# EAGLE design Motor board (2020 edit) (EAGLE 9.5.2)
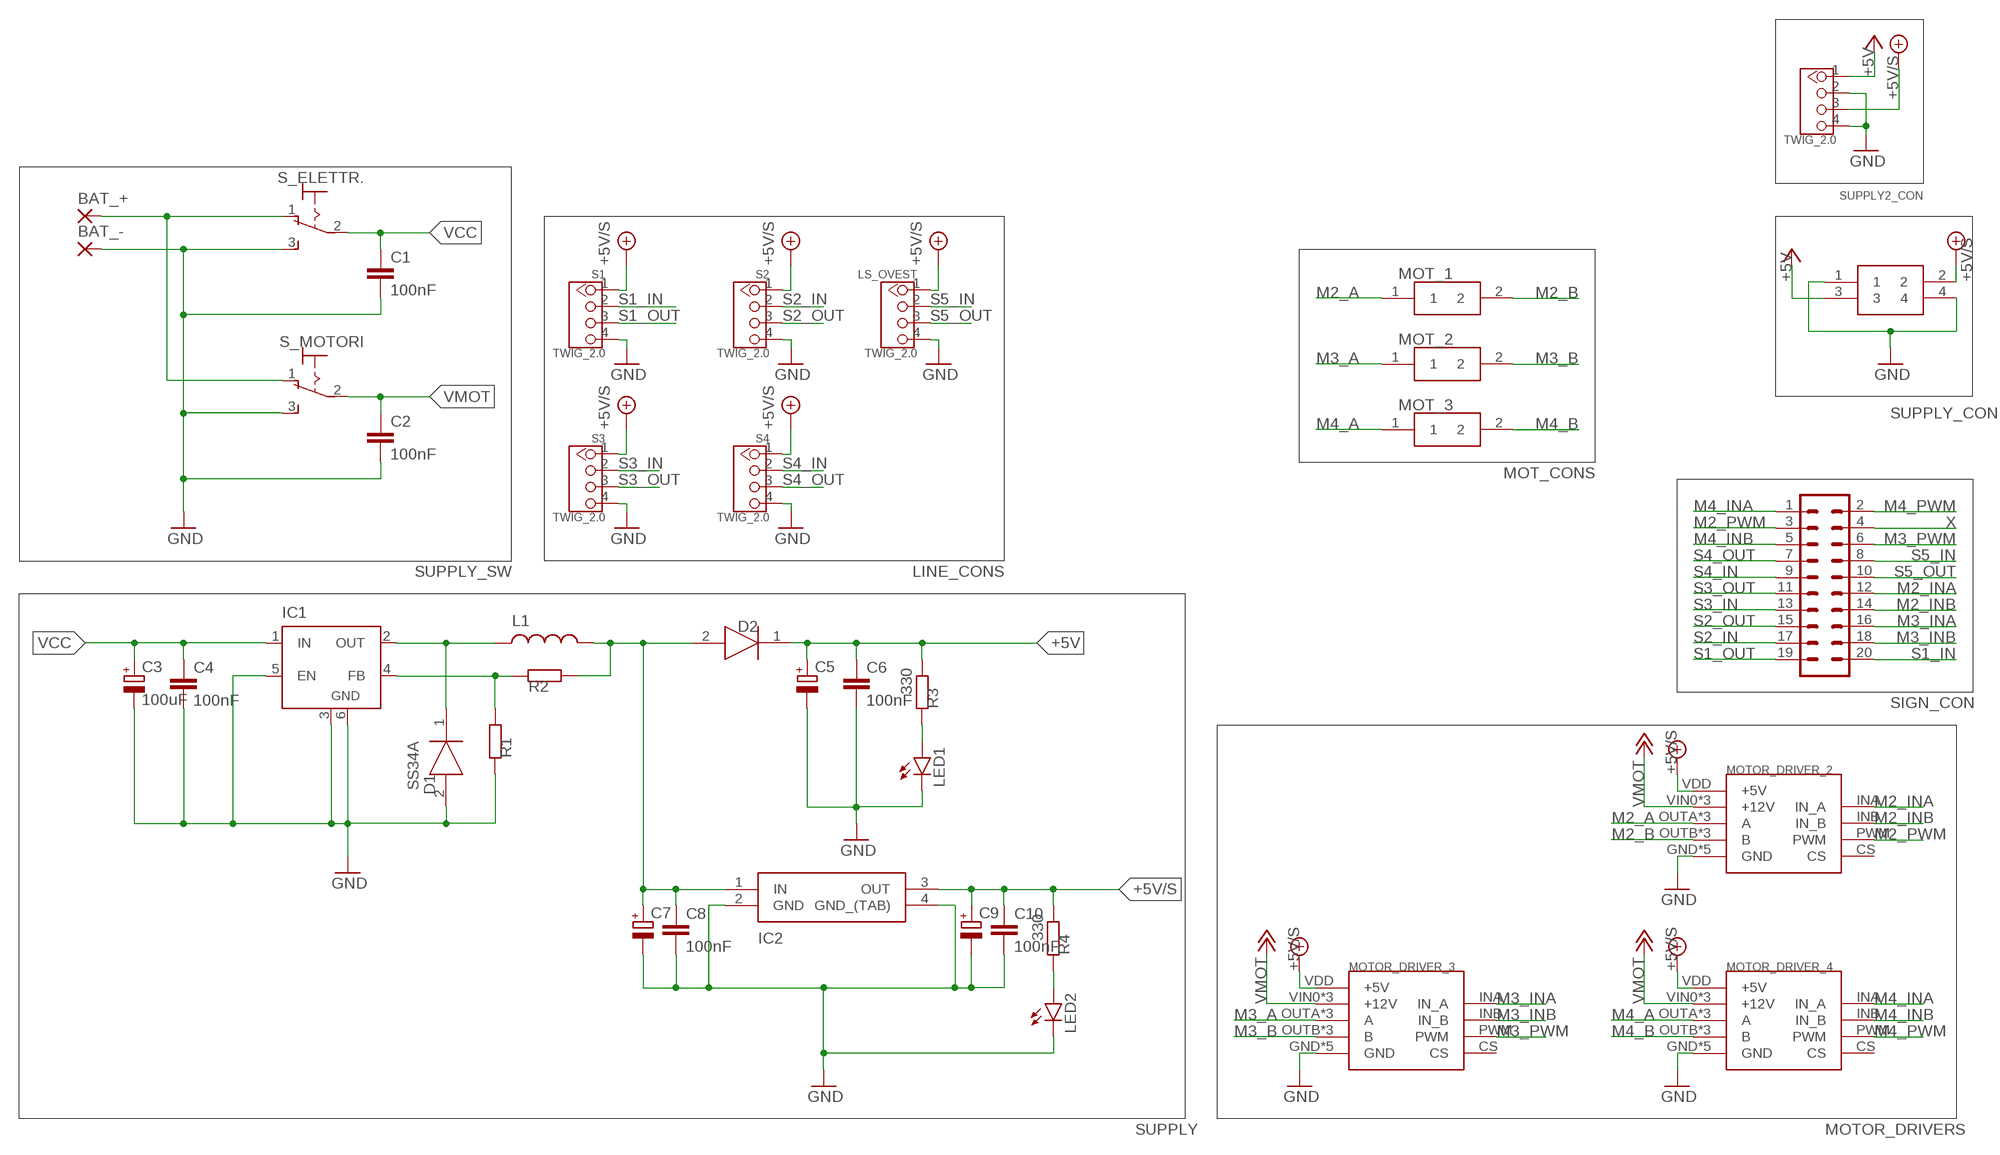
[diagram p0: schematic, sheet 1]

## Parts
BAT_+  3,81/1,4  [3,81/1,4]
BAT_-  3,81/1,4  [3,81/1,4]
C1  100nF  C-EUC1206  [C1206]
C2  100nF  C-EUC1206  [C1206]
C3  100uF  CPOL-EUCT7343  [CT7343]
C4  100nF  C-EUC1206  [C1206]
C5  CPOL-EUE  [PANASONIC_E]
C6  100nF  C-EUC1206  [C1206]
C7  CPOL-EUE  [PANASONIC_E]
C8  100nF  C-EUC1206  [C1206]
C9  CPOL-EUE  [PANASONIC_E]
C10  100nF  C-EUC1206  [C1206]
D1  SS34A  [DIOM5026X262N]
D2  SE20FG-M3_H  [SODFL3718X108N]
IC1  LM2596S  [TO263-5]
IC2  LM2940CS-5.0_NOPB  [TO254P1435X464-4N]
L1  47uH  MSS1260  [MSS1260]
LED1  LEDSML1206  [SML1206]
LED2  LEDSML1206  [SML1206]
LS_OVEST  TWIG_2.0  [2.0_1X4]
MOT_1  43650-0201  [43650-0200]
MOT_2  43650-0201  [43650-0200]
MOT_3  43650-0201  [43650-0200]
MOTOR_DRIVER_2  VNH5019  [VNH5019]
MOTOR_DRIVER_3  VNH5019  [VNH5019]
MOTOR_DRIVER_4  VNH5019  [VNH5019]
R1  330  R-EU_R1206  [R1206]
R2  1,2k  R-EU_R1206  [R1206]
R3  330  R-EU_R1206  [R1206]
R4  330  R-EU_R1206  [R1206]
S1  TWIG_2.0  [2.0_1X4]
S2  TWIG_2.0  [2.0_1X4]
S3  TWIG_2.0  [2.0_1X4]
S4  TWIG_2.0  [2.0_1X4]
S_ELETTR.  320-916  [320-916]
S_MOTORI  320-916  [320-916]
SIGN_CON  20V  [20V]
SUPPLY2_CON  TWIG_2.0  [2.0_1X4]
SUPPLY_CON  39-28-1043  [39-28-1043]

## Nets
5.7V-DIRAMAZIONE2: C7.+ C8.1 D2.2(A) IC2.1(IN) L1.P$1 R2.1
+5V: C5.+ C6.1 D2.1(K) R3.1 SUPPLY2_CON.1 SUPPLY_CON.3
+5V/S: C9.+ C10.1 IC2.3(OUT) LS_OVEST.1 MOTOR_DRIVER_2.VDD(+5V) MOTOR_DRIVER_3.VDD(+5V) MOTOR_DRIVER_4.VDD(+5V) R4.1 S1.1 S2.1 S3.1 S4.1 SUPPLY2_CON.3 SUPPLY_CON.2 ; supply symbol labelled +5V/1
GND [Power]: BAT_-.1(P) C1.2 C2.2 C3.- C4.2 C5.- C6.2 C7.- C8.2 C9.- C10.2 D1.2(A) IC1.3(GND) IC1.5(EN) IC1.6(GND) IC2.2(GND) IC2.4(GND_(TAB)) LED1.C LED2.C LS_OVEST.4 MOTOR_DRIVER_2.GND MOTOR_DRIVER_2.GND0(GND) MOTOR_DRIVER_2.GND1(GND) MOTOR_DRIVER_2.GND2(GND) MOTOR_DRIVER_2.GND3(GND) MOTOR_DRIVER_3.GND MOTOR_DRIVER_3.GND0(GND) MOTOR_DRIVER_3.GND1(GND) MOTOR_DRIVER_3.GND2(GND) MOTOR_DRIVER_3.GND3(GND) MOTOR_DRIVER_4.GND MOTOR_DRIVER_4.GND0(GND) MOTOR_DRIVER_4.GND1(GND) MOTOR_DRIVER_4.GND2(GND) MOTOR_DRIVER_4.GND3(GND) R1.1 S1.4 S2.4 S3.4 S4.4 S_ELETTR..3(S) S_MOTORI.3(S) SUPPLY2_CON.2 SUPPLY2_CON.4 SUPPLY_CON.1 SUPPLY_CON.4
M2_A: MOT_1.1 MOTOR_DRIVER_2.OUTA2(A) MOTOR_DRIVER_2.OUTA3(A) MOTOR_DRIVER_2.OUTA(A)
M2_B: MOT_1.2 MOTOR_DRIVER_2.OUTB1(B) MOTOR_DRIVER_2.OUTB3(B) MOTOR_DRIVER_2.OUTB(B)
M2_INA: MOTOR_DRIVER_2.INA(IN_A) SIGN_CON.12
M2_INB: MOTOR_DRIVER_2.INB(IN_B) SIGN_CON.14
M2_PWM: MOTOR_DRIVER_2.PWM SIGN_CON.3
M3_A: MOT_2.1 MOTOR_DRIVER_3.OUTA2(A) MOTOR_DRIVER_3.OUTA3(A) MOTOR_DRIVER_3.OUTA(A)
M3_B: MOT_2.2 MOTOR_DRIVER_3.OUTB1(B) MOTOR_DRIVER_3.OUTB3(B) MOTOR_DRIVER_3.OUTB(B)
M3_INA: MOTOR_DRIVER_3.INA(IN_A) SIGN_CON.16
M3_INB: MOTOR_DRIVER_3.INB(IN_B) SIGN_CON.18
M3_PWM: MOTOR_DRIVER_3.PWM SIGN_CON.6
M4_A: MOT_3.1 MOTOR_DRIVER_4.OUTA2(A) MOTOR_DRIVER_4.OUTA3(A) MOTOR_DRIVER_4.OUTA(A)
M4_B: MOT_3.2 MOTOR_DRIVER_4.OUTB1(B) MOTOR_DRIVER_4.OUTB3(B) MOTOR_DRIVER_4.OUTB(B)
M4_INA: MOTOR_DRIVER_4.INA(IN_A) SIGN_CON.1
M4_INB: MOTOR_DRIVER_4.INB(IN_B) SIGN_CON.5
M4_PWM: MOTOR_DRIVER_4.PWM SIGN_CON.2
N$1 [Power]: BAT_+.1(P) S_ELETTR..1(O) S_MOTORI.1(O)
N$2: LED2.A R4.2
N$3: LED1.A R3.2
N$6: D1.1(K) IC1.2(OUT) L1.P$2
N$7: IC1.4(FB) R1.2 R2.2
S1_IN: S1.2 SIGN_CON.20
S1_OUT: S1.3 SIGN_CON.19
S2_IN: S2.2 SIGN_CON.17
S2_OUT: S2.3 SIGN_CON.15
S3_IN: S3.2 SIGN_CON.13
S3_OUT: S3.3 SIGN_CON.11
S4_IN: S4.2 SIGN_CON.9
S4_OUT: S4.3 SIGN_CON.7
S5_IN: LS_OVEST.2 SIGN_CON.8
S5_OUT: LS_OVEST.3 SIGN_CON.10
VCC: C1.1 C3.+ C4.1 IC1.1(IN) S_ELETTR..2(P)
VMOT [Power]: C2.1 MOTOR_DRIVER_2.VIN0(+12V) MOTOR_DRIVER_2.VIN1(+12V) MOTOR_DRIVER_2.VIN2(+12V) MOTOR_DRIVER_3.VIN0(+12V) MOTOR_DRIVER_3.VIN1(+12V) MOTOR_DRIVER_3.VIN2(+12V) MOTOR_DRIVER_4.VIN0(+12V) MOTOR_DRIVER_4.VIN1(+12V) MOTOR_DRIVER_4.VIN2(+12V) S_MOTORI.2(P) ; supply symbol labelled +12V
X: SIGN_CON.4
Unconnected: MOTOR_DRIVER_2.CS MOTOR_DRIVER_3.CS MOTOR_DRIVER_4.CS

## Notes on the sheet
- MOT_CONS
- SUPPLY_SW | LINE_CONS
- SUPPLY | MOTOR_DRIVERS

## Library data of the parts
BAT_+ BAT_- = wirepad:3,81/1,4: THROUGH-HOLE PAD
C1 C2 C4 C6 C8 C10 = rcl:C-EU: CAPACITOR, European symbol; SPICEPREFIX: C
C3 C5 C7 C9 = rcl:CPOL-EU: POLARIZED CAPACITOR, European symbol; SPICEPREFIX: C
D1 = SamacSys_Parts:SS34A: HY Electronic Corp SS34A, SMT Rectifier Schottky Diode, 40V 3A, 2-Pin SMA Source: Datasheet <http://uk.rs-online.com/web/p/products/1711454>; DESCRIPTION: HY Electronic Corp SS34A, SMT Rectifier Schottky Diode, 40V 3A, 2-Pin SMA; HEIGHT: 2.62mm; MANUFACTURER_NAME: HY Electronic Corp; MANUFACTURER_PART_NUMBER: SS34A; RS_PART_NUMBER: 1711454
D2 = SE20FG-M3_H:SE20FG-M3_H: Diode Rectifier 2A 400V Standard DO219AB Vishay SE20FG-M3/H, SMT Diode, 400V 2A, 920ns, 2-Pin DO-219AB Source: Datasheet <http://uk.rs-online.com/web/p/products/8949262P>; DESCRIPTION: Diode Rectifier 2A 400V Standard DO219AB Vishay SE20FG-M3/H, SMT Diode, 400V 2A, 920ns, 2-Pin DO-219AB; HEIGHT: 1.08mm; MANUFACTURER_NAME: Vishay; MANUFACTURER_PART_NUMBER: SE20FG-M3/H; RS_PART_NUMBER: 8949262P
IC1 = linear:LM2596S: STEP-DOWN VOLTAGE REGULATOR
IC2 = LM2940CS-5.0_NOPB:LM2940CS-5.0_NOPB: 1A,5V,LDO Voltage Regulator,LM2940CS-5.0 Source: Datasheet <http://www.ti.com/lit/ds/symlink/lm2940c.pdf>; DESCRIPTION: 1A,5V,LDO Voltage Regulator,LM2940CS-5.0; HEIGHT: 4.64mm; MANUFACTURER_NAME: Texas Instruments; MANUFACTURER_PART_NUMBER: LM2940CS-5.0/NOPB; MOUSER_PART_NUMBER: 926-LM2940CS-5.0NOPB; MOUSER_PRICE-STOCK: https://www.mouser.com/Search/Refine.aspx?Keyword=926-LM2940CS-5.0NOPB; RS_PART_NUMBER: 2508123693; RS_PRICE-STOCK: http://uk.rs-online.com/web/p/products/2508123693
L1 = inductor-coilcraft:MSS1260: SMT Power Inductor
LED1 LED2 = led:LED: LED OSRAM: - CHIPLED LG R971, LG N971, LY N971, LG Q971, LY Q971, LO R971, LY R971 LH N974, LH R974 LS Q976, LO Q976, LY Q976 LO Q996 - Hyper CHIPLED LW Q18S LB Q993, LB Q99A, LB R99A - SideLED LS A670, LO A670, LY A670, LG A670, LP A670 LB A673, LV A673, LT A673, LW A673 LH A674 LY A675 LS A676, LA A676, LO A676, LY A676, LW A676 LS A679, LY A679, LG A679 - Hyper Micro SIDELED® LS Y876, LA Y876, LO Y876, LY Y876 LT Y87S - SmartLED LW L88C, LW L88S LB L89C, LB L89S, LG L890 LS L89K, LO L89K, LY L89K LS L896, LA L896, LO L896, LY L896 - TOPLED LS T670, LO T670, LY T670, LG T670, LP T670 LSG T670, LSP T670, LSY T670, LOP T670, LYG T670 LG T671, LOG T671, LSG T671 LB T673, LV T673, LT T673, LW T673 LH T674 LS T676, LA T676, LO T676, LY T676, LB T676, LH T676, LSB T676, LW T676 LB T67C, LV T67C, LT T67C, LS T67K, LO T67K, LY T67K, LW E67C LS E67B, LA E67B, LO E67B, LY E67B, LB E67C, LV E67C, LT E67C LW T67C LS T679, LY T679, LG T679 LS T770, LO T770, LY T770, LG T770, LP T770 LB T773, LV T773, LT T773, LW T773 LH T774 LS E675, LA E675, LY E675, LS T675 LS T776, LA T776, LO T776, LY T776, LB T776 LHGB T686 LT T68C, LB T68C - Hyper Mini TOPLED® LB M676 - Mini TOPLED Santana® LG M470 LS M47K, LO M47K, LY M47K Source: http://www.osram.convergy.de LUXEON: - LUMILED® LXK2-PW12-R00, LXK2-PW12-S00, LXK2-PW14-U00, LXK2-PW14-V00 LXK2-PM12-R00, LXK2-PM12-S00, LXK2-PM14-U00 LXK2-PE12-Q00, LXK2-PE12-R00, LXK2-PE12-S00, LXK2-PE14-T00, LXK2-PE14-U00 LXK2-PB12-K00, LXK2-PB12-L00, LXK2-PB12-M00, LXK2-PB14-N00, LXK2-PB14-P00, LXK2-PB14-Q00 LXK2-PR12-L00, LXK2-PR12-M00, LXK2-PR14-Q00, LXK2-PR14-R00 LXK2-PD12-Q00, LXK2-PD12-R00, LXK2-PD12-S00 LXK2-PH12-R00, LXK2-PH12-S00 LXK2-PL12-P00, LXK2-PL12-Q00, LXK2-PL12-R00 Source: www.luxeon.com KINGBRIGHT: KA-3528ASYC Source: www.kingbright.com
LS_OVEST S1-S4 SUPPLY2_CON = CONNECTER:TWIG_2.0
MOT_1-MOT_3 = Molex motor connector:43650-0201: MOLEX - 43650-0201 - PLUG & SOCKET CONNECTOR, HEADER 2POS 3MM Source: Datasheet <https://www.molex.com/pdm_docs/sd/436500201_sd.pdf>; ALLIED_NUMBER: 70090754; ALLIED_PRICE-STOCK: https://www.alliedelec.com/molex-incorporated-43650-0201/70090754/; DESCRIPTION: MOLEX - 43650-0201 - PLUG & SOCKET CONNECTOR, HEADER 2POS 3MM; HEIGHT: mm; MANUFACTURER_NAME: Molex; MANUFACTURER_PART_NUMBER: 43650-0201; MOUSER_PART_NUMBER: 538-43650-0201; MOUSER_PRICE-STOCK: https://www.mouser.com/Search/Refine.aspx?Keyword=538-43650-0201
MOTOR_DRIVER_2-MOTOR_DRIVER_4 = DRIVER POLOLU:VNH5019: aggiornato il 24/10/14 con pin cs (AD)
R1-R4 = rcl:R-EU_: RESISTOR, European symbol; SPICEPREFIX: R
S_ELETTR. S_MOTORI = switch:320-916: TOGGLE SWITCH distributor RS Components
SIGN_CON = con-harting-v-edit:20V: CONNECTOR; OC_FARNELL: unknown; OC_NEWARK: unknown
SUPPLY_CON = 39-28-1043:39-28-1043: Mini-Fit Jr. Vertical Header, 4.20mm Pitch, Dual Row, 4 Circuits, without Snap-in Plastic Peg PCB Lock, Tin, Natural Source: Datasheet <http://docs-emea.rs-online.com/webdocs/0460/0900766b80460da1.pdf>; DESCRIPTION: Mini-Fit Jr. Vertical Header, 4.20mm Pitch, Dual Row, 4 Circuits, without Snap-in Plastic Peg PCB Lock, Tin, Natural; HEIGHT: mm; MANUFACTURER_NAME: Molex; MANUFACTURER_PART_NUMBER: 39-28-1043; MOUSER_PART_NUMBER: 538-39-28-1043; MOUSER_PRICE-STOCK: https://www.mouser.com/Search/Refine.aspx?Keyword=538-39-28-1043; RS_PART_NUMBER: 4841899P; RS_PRICE-STOCK: http://uk.rs-online.com/web/p/products/4841899P

## Net classes
1 Power: width 0.508 mm, clearance 0.508 mm

## Board
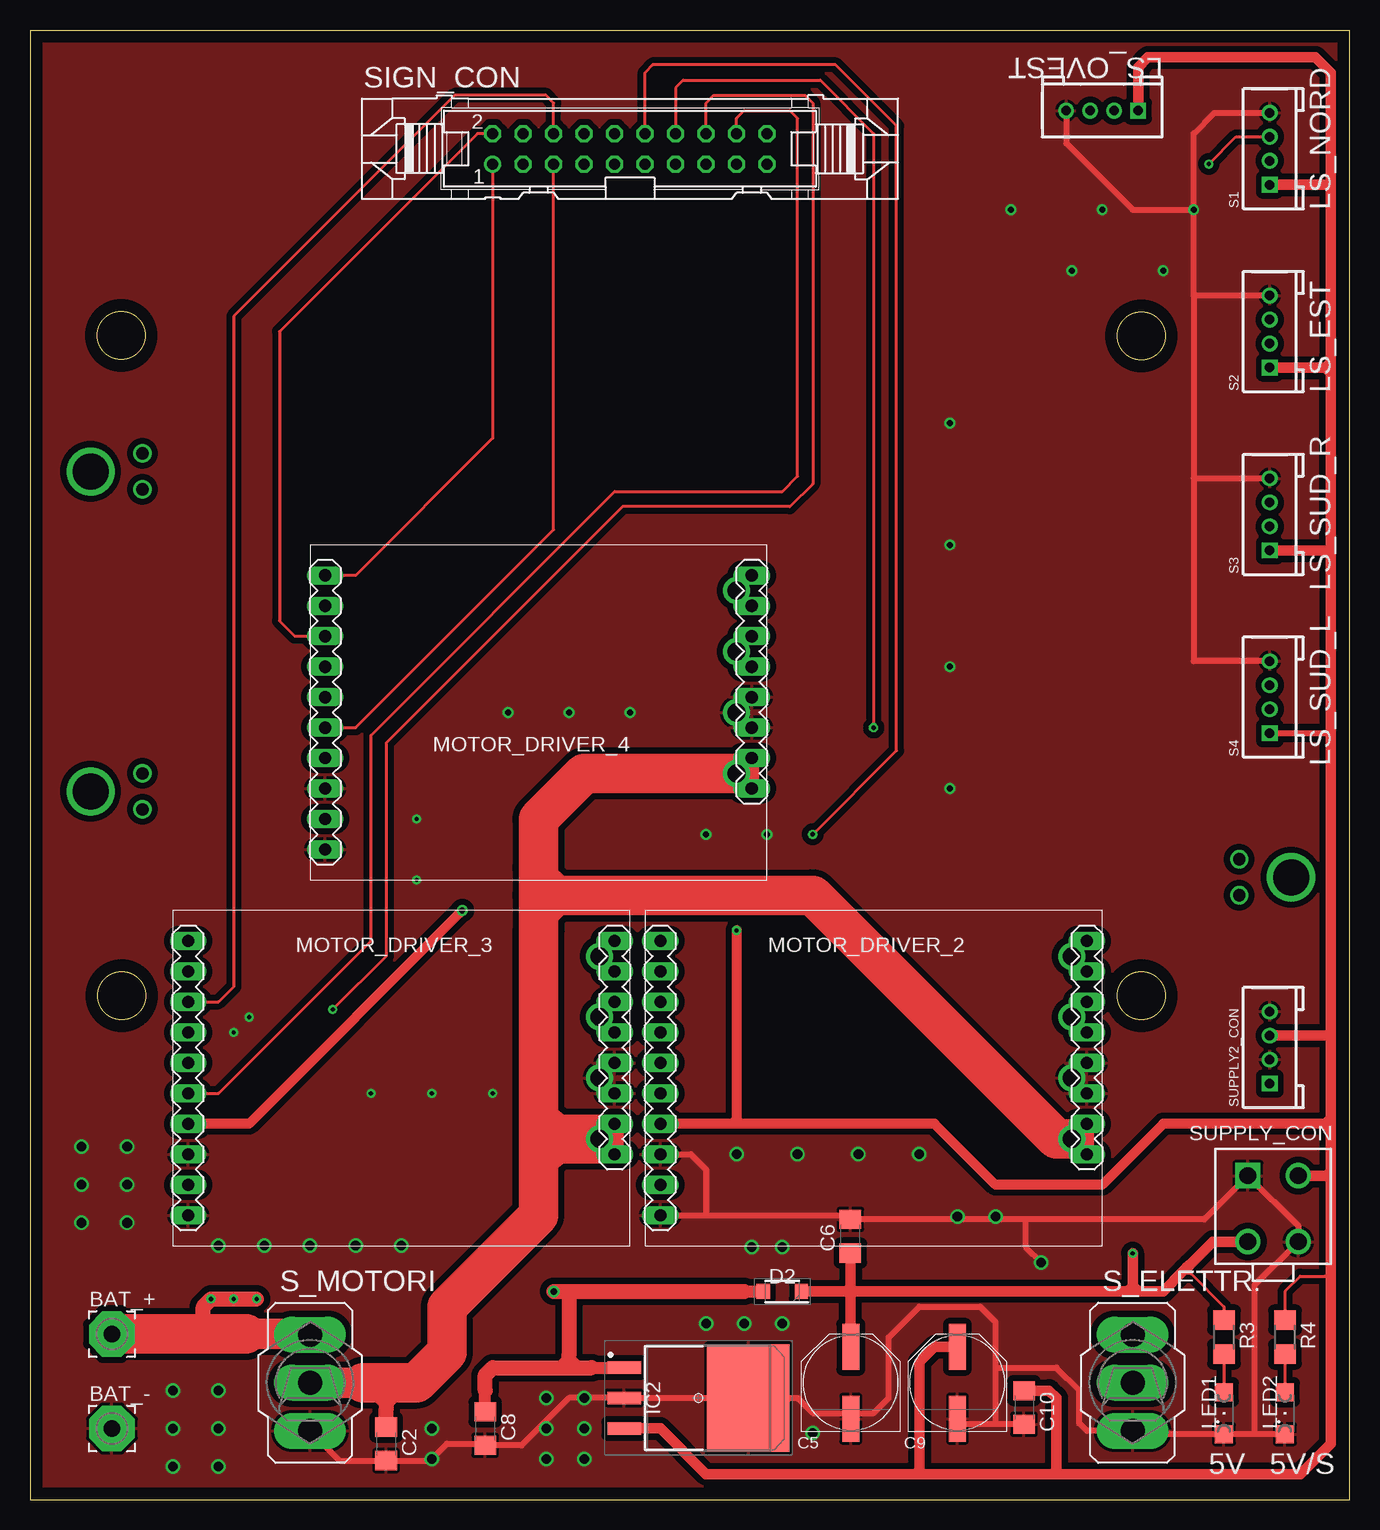
[diagram p1: board, top side]
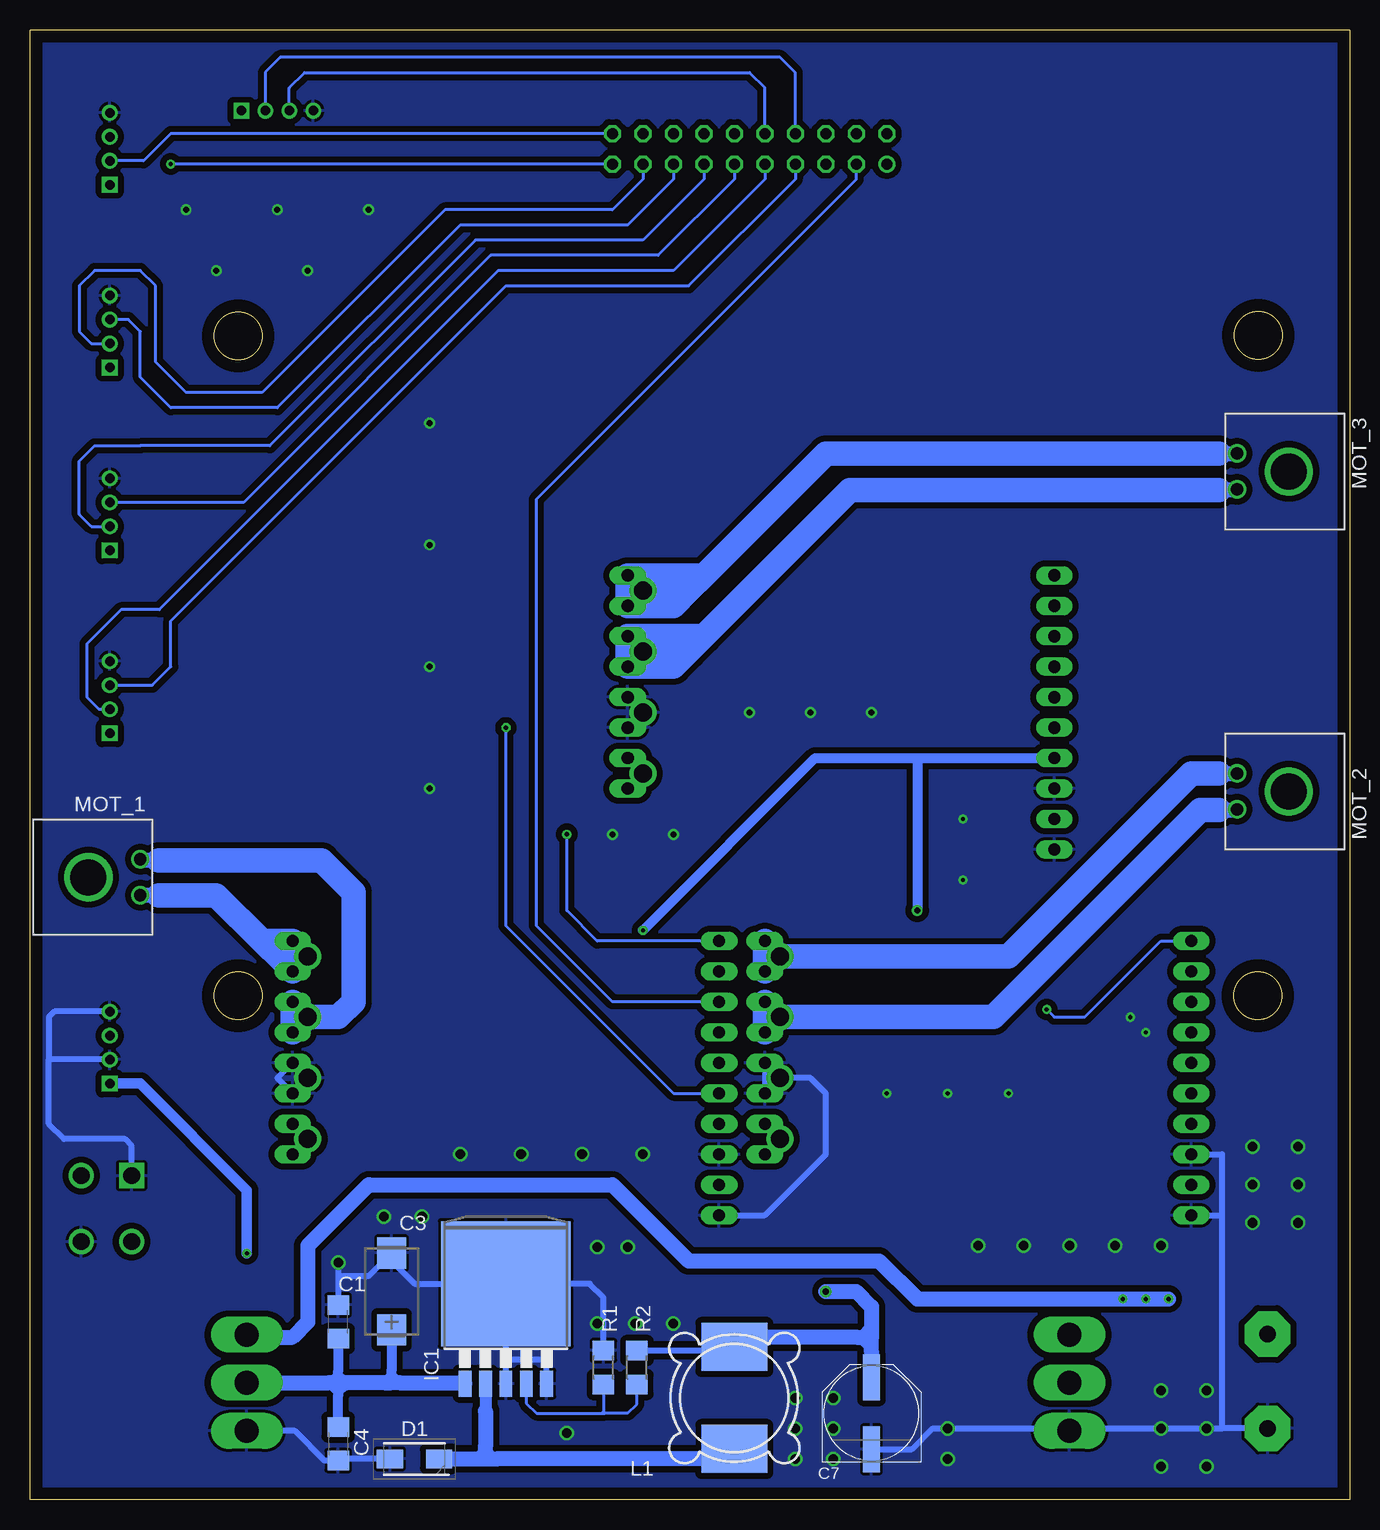
[diagram p2: board, bottom side, seen from below]

Size 110 x 122.5 mm. Coordinates in mm from the lower left corner, seen from the top.
Outline: 110,0 110,122.5 0,122.5 0,0 110,0
Outline: circle at 7.64,42.01 radius 2
Outline: circle at 7.6,97.05 radius 2
Outline: circle at 92.64,97.01 radius 2
Outline: circle at 92.64,42.01 radius 2
Copper layers (1*16): Top 0.035mm / dielectric 1.5mm / Bottom 0.035mm
Design rules "default *": minimum track width 6mil, minimum drill 0.35mm, track to track 5mil, track to pad 7mil, pad to pad 10mil, via to via 10mil, smd to smd 6mil, copper to edge 40mil, drill to drill 6mil, minimum pad ring 10mil, minimum via ring 8mil, stop-mask expansion 4mil, vias tented up to drill 0mil, thermal gap 10mil

### Footprints (pad centres in the part's own frame; a part is rotated, then mirrored left to right if it is on the bottom)
3,81/1,4 = drill 1.397 pad 3.81 octagon: 1 0,0
C1206 = smd 1.6 x 1.8: 1 -1.4,0; 2 1.4,0
CT7343 = smd 2.6 x 2.4: + -3.2,0; - 3.2,0
PANASONIC_E = smd 3.8 x 1.4: + 3,0; - -3,0
DIOM5026X262N = smd 2.2 x 1.55: 1 -2.05,0; 2 2.05,0
SODFL3718X108N = smd 1.12 x 1.22: 1 -1.6,0; 2 1.6,0
TO263-5 = smd 1.067 x 2.159: 1 -3.404,-5.791; 2 -1.702,-5.791; 3 0,-5.791; 4 1.702,-5.791; 5 3.404,-5.791 | smd 10.8 x 10.41: 6 0,2.54
TO254P1435X464-4N = smd 2.8 x 1.05: 1 -6.2,2.54; 2 -6.2,0; 3 -6.2,-2.54 | smd 6.85 x 8.95: 4 4.15,0
MSS1260 = smd 5.5 x 4: P$1 0,4.25; P$2 0,-4.25
SML1206 = smd 1.5 x 1.5: A 1.75,0; C -1.75,0
2.0_1X4 = drill 0.8 pad 1.27 square: 1 -3,0 | drill 0.8 pad 1.27: 2 -1,0; 3 1,0; 4 3,0
43650-0200 = drill 1.02 pad 1.52: 1 0,0; 2 -3,0 | drill 3 pad 3: 3 -1.5,-4.32
VNH5019 = drill 1.016 long: CS 1.27,17.78; ENA 1.27,22.86; ENB 1.27,15.24; GND 1.27,7.62; GND0 36.83,12.7; GND1 1.27,2.54; GND2 36.83,15.24; INA 1.27,25.4; INB 1.27,12.7; OUTA 36.83,22.86; OUTA2 36.83,25.4; OUTB 36.83,17.78; OUTB1 36.83,20.32; PWM 1.27,20.32; VDD 1.27,10.16; VIN0 36.83,7.62; VIN1 36.83,10.16; VOUT 1.27,5.08 | drill 1.5: GND3 35.56,13.97; OUTA3 35.56,24.13; OUTB3 35.56,19.05; VIN2 35.56,8.89
R1206 = smd 1.6 x 1.803: 1 -1.422,0; 2 1.422,0
320-916 = drill 2.007 long: 1 0,4.013; 2 0,0; 3 0,-4.013
20V = drill 0.914: 1 -11.43,-1.27 | drill 0.914 octagon: 2 -11.43,1.27; 3 -8.89,-1.27; 4 -8.89,1.27; 5 -6.35,-1.27; 6 -6.35,1.27; 7 -3.81,-1.27; 8 -3.81,1.27; 9 -1.27,-1.27; 10 -1.27,1.27; 11 1.27,-1.27; 12 1.27,1.27; 13 3.81,-1.27; 14 3.81,1.27; 15 6.35,-1.27; 16 6.35,1.27; 17 8.89,-1.27; 18 8.89,1.27; 19 11.43,-1.27; 20 11.43,1.27
39-28-1043 = drill 1.4 pad 2.1 square: 1 -2.1,7.35 | drill 1.4 pad 2.1: 2 2.1,7.35; 3 -2.1,1.85; 4 2.1,1.85

### Placement (x,y rotation side)
BAT_+  6.83,13.79 0 top
BAT_-  6.83,5.92 0 top
C1  84.3,14.81 90 bottom
C2  29.69,4.65 270 top
C3  79.86,17.35 90 bottom
C4  84.3,4.65 270 bottom
C5  68.42,9.73 90 top
C6  68.38,21.95 90 top
C7  39.85,7.19 90 bottom
C8  37.94,5.92 270 top
C9  77.31,9.73 90 top
C10  82.87,7.67 270 top
D1  77.95,3.38 180 bottom
D2  62.71,17.35 180 top
IC1  70.33,15.44 0 bottom
IC2  55.72,8.46 0 top
L1  51.28,8.46 0 bottom
LED1  99.54,7.19 90 top
LED2  104.62,7.19 90 top
LS_OVEST  89.38,115.78 180 top
MOT_1  100.81,50.37 270 bottom
MOT_2  9.37,60.53 90 bottom
MOT_3  9.37,87.2 90 bottom
MOTOR_DRIVER_2  51.28,21.16 0 top
MOTOR_DRIVER_3  11.91,21.16 0 top
MOTOR_DRIVER_4  23.34,51.64 0 top
R1  62.2,11 270 bottom
R2  59.41,11 270 bottom
R3  99.54,13.54 270 top
R4  104.62,13.54 270 top
S1  103.35,112.6 90 top
S2  103.35,97.36 90 top
S3  103.35,82.12 90 top
S4  103.35,66.88 90 top
S_ELETTR.  91.92,9.73 0 top
S_MOTORI  23.34,9.73 0 top
SIGN_CON  50.01,112.6 0 top
SUPPLY2_CON  103.35,37.67 90 top
SUPPLY_CON  103.63,19.65 0 top

### Tracks (layer width: path | path; a pad name or v marks a point on that pad's centre or on a via)
5.7V-DIRAMAZIONE2  (via drill 0.55)
  Top 0.305: 44.17,11.51 44.68,12.02 44.93,12.02 45.18,12.02 45.69,11.51
  Top 1.016: 46.83,11 IC2.1 | C8.1 37.94,9.09 | 59.53,17.35 D2.2
  Top 1.27: v43.66,17.35 44.93,17.35 | 44.93,17.35 44.93,12.02 44.93,11 | 44.93,11 46.83,11 | 37.94,9.09 37.94,10.37 38.58,11 44.93,11 | 44.93,17.35 59.53,17.35
  Bottom 0.406: 39.85,12.27 41.12,13.54 39.85,14.81
  Bottom 0.508: R2.1 51.64,12.42 51.28,12.78
  Bottom 1.016: C7.+ 39.85,12.27
  Bottom 1.27: v43.66,17.35 41.12,17.35 39.85,16.08 39.85,14.81 39.85,13.54 | 39.85,13.54 41.12,13.54 50.52,13.54 51.28,12.78 L1.P$1 | 39.85,12.27 39.85,13.54
+5V  (via drill 0.35)
  Top 0.152: 96.11,19 96.3,18.81 96.81,18.81 96.81,19.44 96.68,19.57
  Top 0.254: 96.36,19.25 96.81,18.81 99.54,16.08 R3.1
  Top 0.305: 67.62,17.35 68.38,16.59 69.06,17.27 69.06,17.35 69.06,17.43 68.38,18.11 67.62,17.35 | 67.62,17.35 67.54,17.35
  Top 0.406: 91.16,17.35 91.92,18.11 92.68,17.35
  Top 0.813: 68.38,12.73 C5.+
  Top 0.889: C6.1 68.38,18.11 68.38,17.35 | 68.38,17.35 68.38,16.59 68.38,12.73 | D2.1 67.54,17.35 68.38,17.35 | 91.92,17.35 92.68,17.35 94.46,17.35 96.11,19 96.36,19.25 96.68,19.57 98.61,21.5 SUPPLY_CON.3 | 91.92,17.35 91.16,17.35 69.06,17.35 68.38,17.35 | v91.92,20.53 91.92,18.11 91.92,17.35
  Bottom 0.889: SUPPLY2_CON.1 100.81,34.67 91.92,25.78 v91.92,20.53
+5V/S  (via drill 0.35, 0.5)
  Top 0.152: 108.43,18.24 108.3,18.24 107.92,18.62 108.43,19.13
  Top 0.254: 108.43,18.62 107.92,18.62 105.89,18.62 104.62,17.35 R4.1
  Top 0.305: 73.38,2.11 74.14,2.87 74.9,2.11 | 84.81,2.11 85.57,2.87 86.33,2.11 | 108.43,27.76 107.67,27 108.17,26.49 108.43,26.49 | 58.14,31.32 58.65,31.83 58.9,31.83 59.15,31.83 59.66,31.32
  Top 0.406: 108.43,32.08 107.67,31.32 108.18,30.81 108.43,30.81
  Top 0.508: 107.67,94.36 107.72,94.36 | 107.72,94.36 108.43,95.07 108.43,95.33 | 107.72,94.36 108.43,93.65 108.43,93.55 | S4.1 108.38,63.88 108.43,63.83
  Top 0.813: 108.43,31.32 107.67,31.32 94.46,31.32 89.38,26.24 80.49,26.24 75.41,31.32 59.66,31.32 58.9,31.32 | 58.9,31.32 58.14,31.32 MOTOR_DRIVER_2.VDD | 58.9,31.32 58.9,31.83 v58.9,47.45 | v36.04,49.1 18.26,31.32 MOTOR_DRIVER_3.VDD
  Top 0.889: IC2.3 52.55,5.92 56.36,2.11 73.38,2.11 74.14,2.11 | C9.+ 75.41,12.73 74.14,11.46 74.14,2.87 74.14,2.11 | 74.14,2.11 74.9,2.11 84.81,2.11 85.57,2.11 | C10.1 84.96,9.07 85.57,8.46 85.57,2.87 85.57,2.11 | 85.57,2.11 86.33,2.11 105.89,2.11 108.43,4.65 108.43,18.24 108.43,18.62 108.43,19.13 108.43,26.49 108.43,27 | SUPPLY_CON.2 107.67,27 108.43,27 | 108.43,27 108.43,27.76 108.43,30.81 108.43,31.32 108.43,32.08 108.43,38.94 | 108.43,38.94 108.16,38.67 SUPPLY2_CON.3 | 108.43,79.07 108.43,93.55 108.43,94.19 | 108.43,94.19 108.43,95.33 108.43,109.55 | 108.43,109.55 108.43,118.95 107.16,120.22 93.19,120.22 92.38,119.41 LS_OVEST.1 | 108.43,94.19 108.25,94.36 107.67,94.36 S2.1 | S3.1 108.38,79.12 108.43,79.07 | 108.43,79.07 108.43,63.83 108.43,38.94 | S1.1 108.38,109.6 108.43,109.55
  Bottom 0.813: v58.9,47.45 44.55,61.8 36.04,61.8 | 36.04,61.8 MOTOR_DRIVER_4.VDD | 36.04,61.8 v36.04,49.1
GND  (via drill 0.35, 0.5, 0.8)
  Top 0.508: S_MOTORI.3 25.81,3.25 C2.2 33.37,3.25 34.77,4.65 37.81,4.65 C8.2 40.99,4.52 44.93,8.46 IC2.2 IC2.4 63.98,8.46 65.25,7.19 67.97,7.19 C5.- 68.89,7.19 70.33,7.19 71.6,8.46 71.6,13.54 74.14,16.08 79.22,16.08 80.49,14.81 80.49,11 | 80.49,11 85.57,11 87.47,9.09 87.47,6.35 88.11,5.72 S_ELETTR..3 92.2,5.44 LED1.C 102.08,5.44 | LED2.C 102.08,5.44 | 102.08,5.44 102.08,17.85 SUPPLY_CON.4 105.73,22.8 SUPPLY_CON.1 97.88,23.35 83.03,23.35 | 83.03,23.35 C6.2 68.03,23.7 56.36,23.7 | MOTOR_DRIVER_2.GND1 56.36,23.7 | MOTOR_DRIVER_2.GND 55.09,28.78 56.36,27.51 56.36,23.7 | C10.2 80.49,6.27 | 80.49,6.27 77.77,6.27 C9.- | 80.49,11 80.49,6.27 | S2.4 97,100.36 | S3.4 97,85.12 | S4.4 97,69.88 97,85.12 | 97,100.36 97,85.12 | LS_OVEST.4 86.38,113.06 91.92,107.52 v97,107.52 | 97,100.36 v97,107.52 | v97,107.52 97,113.87 98.73,115.6 S1.4 | v84.3,19.76 83.03,21.03 83.03,23.35
  Bottom 0.508: BAT_-.1 10.64,5.92 | 10.64,5.92 23.14,5.92 S_MOTORI.3 23.54,5.92 34.77,5.92 36.5,4.19 C7.- | 84.3,19.89 84.3,18.62 | 84.3,18.62 C1.2 | 84.3,18.62 81.78,18.62 C3.- 79.86,19.89 77.95,17.98 IC1.6 | MOTOR_DRIVER_2.GND1 48.74,23.7 43.66,28.78 43.66,33.86 44.93,35.13 MOTOR_DRIVER_3.GND3 | MOTOR_DRIVER_3.GND3 MOTOR_DRIVER_3.GND0 MOTOR_DRIVER_3.GND2 MOTOR_DRIVER_3.GND3 | MOTOR_DRIVER_3.GND1 10.64,23.7 | 10.64,23.7 10.64,5.92 | MOTOR_DRIVER_3.GND 10.64,28.78 10.64,23.7 | D1.2 84.17,3.38 C4.2 85.44,3.25 87.91,5.72 S_ELETTR..3 | IC1.3 70.33,11.64 | 70.33,11.64 IC1.6 | IC1.5 66.93,11.41 67.16,11.64 70.33,11.64 | R1.1 62.2,16.84 63.34,17.98 IC1.6 | SUPPLY_CON.1 101.53,29.5 102.08,30.05 107.16,30.05 108.43,31.32 108.43,36.67 | SUPPLY2_CON.2 108.43,36.67 | 108.43,36.67 108.43,40.21 107.97,40.67 SUPPLY2_CON.4 | 89.38,35.13 MOTOR_DRIVER_2.GND0 MOTOR_DRIVER_2.GND3 MOTOR_DRIVER_2.GND2 89.38,35.13
  other vias: 8.1,26.24 8.1,29.42 8.1,23.06 11.91,5.92 11.91,9.09 11.91,2.74 15.72,5.92 15.72,9.09 15.72,2.74 4.29,26.24 4.29,29.42 4.29,23.06 33.5,5.92 33.5,3.38 43.03,3.38 46.2,3.38 46.2,5.92 46.2,8.46 43.03,8.46 43.03,5.92 65.25,5.54 62.71,14.68 59.53,14.68 56.36,14.68 62.71,21.03 60.17,21.03 77.31,23.57 80.49,23.57 58.9,28.78 63.98,28.78 69.06,28.78 74.14,28.78 30.96,21.16 27.15,21.16 23.34,21.16 19.53,21.16 15.72,21.16 89.38,107.52 81.76,107.52 86.84,102.44 94.46,102.44 76.68,89.74 76.68,79.58 76.68,69.42 76.68,59.26 16.99,38.94 18.26,40.21 28.42,33.86 33.5,33.86 38.58,33.86 32.23,56.72 32.23,51.64 56.36,55.45 61.44,55.45 39.85,65.61 44.93,65.61 50.01,65.61
  pour Top (isolate 0.508): -2.06,124.03 110.97,124.03 110.97,-1.7 -2.06,-1.7
  pour Bottom (isolate 0.508): -0.79,125.3 112.24,125.3 112.24,-0.43 -0.79,-0.43
M2_A
  Bottom 1.27: 99.29,50.37 MOT_1.1
  Bottom 1.651: 88.8,44.71 88.8,44.77 | 89.88,45.85 89.94,45.85
  Bottom 2.032: MOTOR_DRIVER_2.OUTA2 90.65,46.56 | 90.65,46.56 94.46,50.37 99.29,50.37 | MOTOR_DRIVER_2.OUTA2 MOTOR_DRIVER_2.OUTA | MOTOR_DRIVER_2.OUTA2 MOTOR_DRIVER_2.OUTA3 | MOTOR_DRIVER_2.OUTA3 MOTOR_DRIVER_2.OUTA | MOTOR_DRIVER_2.OUTA3 89.32,45.29 | 89.32,45.29 89.88,45.85 | 89.94,45.85 90.65,46.56 | MOTOR_DRIVER_2.OUTA 88.8,44.71 | 88.8,44.77 89.32,45.29
M2_B
  Bottom 1.27: 99.29,53.29 100.73,53.29 MOT_1.2
  Bottom 2.032: MOTOR_DRIVER_2.OUTB3 84.3,40.21 83.03,41.48 83.03,50.62 85.7,53.29 99.29,53.29 | MOTOR_DRIVER_2.OUTB3 MOTOR_DRIVER_2.OUTB MOTOR_DRIVER_2.OUTB1 MOTOR_DRIVER_2.OUTB3
M2_INA  (via drill 0.35)
  Top 0.254: SIGN_CON.12 51.28,118.95 51.92,119.59 67.16,119.59 72.23,114.5 72.23,62.44 v65.25,55.45
  Bottom 0.254: MOTOR_DRIVER_2.INA 62.71,46.56 65.25,49.1 v65.25,55.45
M2_INB  (via drill 0.35)
  Top 0.254: SIGN_CON.14 53.82,117.68 54.45,118.31 65.89,118.31 70.33,113.87 v70.33,64.34
  Bottom 0.254: MOTOR_DRIVER_2.INB 56.36,33.86 70.33,47.83 v70.33,64.34
M2_PWM
  Bottom 0.254: MOTOR_DRIVER_2.PWM 61.44,41.48 67.79,47.83 67.79,83.39 41.12,110.06 SIGN_CON.3
M3_A
  Bottom 1.27: 10.89,60.53 MOT_2.1
  Bottom 2.032: MOTOR_DRIVER_3.OUTA3 28.42,45.29 13.18,60.53 10.89,60.53 | MOTOR_DRIVER_3.OUTA3 MOTOR_DRIVER_3.OUTA2 MOTOR_DRIVER_3.OUTA MOTOR_DRIVER_3.OUTA3
M3_B
  Bottom 1.27: 10.89,57.48 9.42,57.48 MOT_2.2
  Bottom 2.032: MOTOR_DRIVER_3.OUTB3 MOTOR_DRIVER_3.OUTB MOTOR_DRIVER_3.OUTB1 MOTOR_DRIVER_3.OUTB3 | MOTOR_DRIVER_3.OUTB3 29.69,40.21 12.42,57.48 10.89,57.48
M3_INA  (via drill 0.35)
  Top 0.254: SIGN_CON.16 56.36,116.41 57,117.04 64.61,117.04 65.25,116.41 65.25,84.66 63.34,82.75 49.38,82.75 29.69,63.07 29.69,45.29 v25.24,40.84
  Bottom 0.254: MOTOR_DRIVER_3.INA 15.72,46.56 22.07,40.21 24.61,40.21 v25.24,40.84
M3_INB
  Top 0.254: SIGN_CON.18 58.9,115.14 59.53,115.78 63.34,115.78 63.98,115.14 63.98,85.29 62.71,84.03 48.74,84.03 28.42,63.7 28.42,46.56 15.72,33.86 MOTOR_DRIVER_3.INB
M3_PWM
  Top 0.254: MOTOR_DRIVER_3.PWM 15.72,41.48 16.99,42.75 16.99,98.63 35.41,117.04 43.03,117.04 43.66,116.41 SIGN_CON.6
M4_A
  Bottom 1.27: 10.89,87.2 MOT_3.1
  Bottom 2.032: MOTOR_DRIVER_4.OUTA3 55.09,75.77 | 55.09,75.77 53.82,77.04 | 53.82,77.04 43.66,87.2 10.89,87.2 | 53.82,77.04 MOTOR_DRIVER_4.OUTA2 MOTOR_DRIVER_4.OUTA 56.36,74.5 55.09,75.77
M4_B
  Bottom 1.27: 10.89,84.15 9.42,84.15 MOT_3.2
  Bottom 2.032: 53.82,71.96 41.63,84.15 10.89,84.15 | 55.09,70.69 56.36,69.42 MOTOR_DRIVER_4.OUTB MOTOR_DRIVER_4.OUTB1 53.82,71.96 | MOTOR_DRIVER_4.OUTB3 55.09,70.69 | 55.09,70.69 53.82,71.96
M4_INA
  Top 0.254: MOTOR_DRIVER_4.INA 27.15,77.04 38.58,88.47 SIGN_CON.1
M4_INB
  Top 0.254: MOTOR_DRIVER_4.INB 27.15,64.34 43.66,80.85 SIGN_CON.5
M4_PWM
  Top 0.254: MOTOR_DRIVER_4.PWM 22.07,71.96 20.8,73.23 20.8,97.36 37.31,113.87 SIGN_CON.2
N$1  (via drill 0.35)
  Top 1.27: 13.18,13.79 14.45,15.06 14.45,16.08 v15.09,16.72 v18.9,16.72 v16.99,16.72
  Top 2.54: 18.01,13.79 23.29,13.79 S_MOTORI.1
  Top 3.302: BAT_+.1 13.18,13.79 18.01,13.79
  Bottom 1.27: S_ELETTR..1 91.72,13.54 88.11,13.54 86.84,14.81 86.84,21.16 81.76,26.24 61.44,26.24 55.09,19.89 39.22,19.89 36.04,16.72 v15.09,16.72
N$2
  Top 0.254: R4.2 LED2.A
N$3
  Top 0.254: R3.2 LED1.A
N$6
  Bottom 0.508: 71.09,3.38 71.09,3.46 72.03,4.4 72.87,3.56 72.87,3.38
  Bottom 0.813: 51.28,4.65 L1.P$2
  Bottom 1.016: IC1.2 72.03,7.39
  Bottom 1.27: 51.28,4.65 51.28,3.38 71.09,3.38 72.23,3.38 | D1.1 72.87,3.38 72.23,3.38 | 72.03,7.39 72.03,4.4 72.03,3.58 72.23,3.38
N$7
  Bottom 0.254: 62.33,7.19 67.79,7.19 68.63,8.03 IC1.4 | 62.33,7.19 62.2,7.19 | 62.2,7.19 62.08,7.19 | 62.08,7.19 60.17,7.19 59.41,7.95 R2.2 | R1.2 62.2,7.32 | 62.2,7.19 62.2,7.32 | 62.08,7.19 62.2,7.32 | 62.2,7.32 62.33,7.19
S1_IN
  Bottom 0.254: SIGN_CON.20 98.27,113.87 100.54,111.6 S1.2
S1_OUT  (via drill 0.35)
  Top 0.254: v98.27,111.33 100.54,113.6 S1.3
  Bottom 0.254: SIGN_CON.19 v98.27,111.33
S2_IN
  Bottom 0.254: SIGN_CON.17 58.9,110.06 61.44,107.52 75.41,107.52 90.65,92.28 97,92.28 99.54,94.82 99.54,101.17 100.81,102.44 104.62,102.44 105.89,101.17 105.89,97.36 104.89,96.36 S2.2
S2_OUT
  Bottom 0.254: SIGN_CON.15 56.36,110.06 60.17,106.25 74.14,106.25 89.38,91.01 98.27,91.01 100.81,93.55 100.81,97.36 101.81,98.36 S2.3
S3_IN
  Bottom 0.254: SIGN_CON.13 53.82,110.06 58.9,104.98 72.87,104.98 90.02,87.84 100.81,87.84 103.35,87.84 104.62,87.84 105.89,86.56 105.89,82.12 104.89,81.12 S3.2
S3_OUT
  Bottom 0.254: SIGN_CON.11 51.28,110.06 57.63,103.71 71.6,103.71 92.19,83.12 102.08,83.12 S3.3
S4_IN
  Bottom 0.254: SIGN_CON.9 48.74,110.06 56.36,102.44 70.97,102.44 99.22,74.18 102.4,74.18 105.25,71.33 105.25,66.88 104.25,65.88 S4.2
S4_OUT
  Bottom 0.254: SIGN_CON.7 46.2,110.06 55.09,101.17 70.33,101.17 98.27,73.23 98.27,69.42 99.81,67.88 S4.3
S5_IN
  Bottom 0.254: SIGN_CON.8 46.2,118.95 47.47,120.22 89.13,120.22 90.38,118.97 LS_OVEST.2
S5_OUT
  Bottom 0.254: SIGN_CON.10 48.74,117.68 50.01,118.95 87.11,118.95 88.38,117.68 LS_OVEST.3
VCC
  Bottom 0.305: 83.54,9.98 84.3,10.75 85.06,9.98 | 79.22,9.73 79.22,10.11 79.86,10.75 80.49,10.11 80.49,9.73
  Bottom 0.406: 83.54,9.98 83.54,9.73 83.54,9.48 84.3,8.71 85.06,9.48 85.06,9.73 85.06,9.98
  Bottom 0.813: C4.1 84.3,8.71 84.3,9.73 84.3,10.75 C1.1 | C3.+ 79.86,10.75 79.86,9.73
  Bottom 1.27: S_ELETTR..2 85.06,9.73 84.3,9.73 83.54,9.73 80.49,9.73 79.86,9.73 79.22,9.73 73.81,9.73 IC1.1
VMOT
  Top 0.508: 27.78,9.73 27.78,9.48 29.69,7.57 30.45,8.33
  Top 0.61: 42.39,52.66 43.41,52.66 44.42,51.64
  Top 1.016: 42.39,47.32 44.93,49.86 | 44.68,31.32 43.41,32.34 | 44.68,28.78 43.41,27.76
  Top 1.27: C2.1 29.69,7.57 29.69,9.73 | MOTOR_DRIVER_2.VIN2 MOTOR_DRIVER_2.VIN1 MOTOR_DRIVER_2.VIN0 MOTOR_DRIVER_2.VIN2 | MOTOR_DRIVER_4.VIN2 MOTOR_DRIVER_4.VIN1 MOTOR_DRIVER_4.VIN0 MOTOR_DRIVER_4.VIN2
  Top 1.524: MOTOR_DRIVER_3.VIN1 44.68,31.32 43.66,31.32 42.39,30.05 43.66,28.78 44.68,28.78 MOTOR_DRIVER_3.VIN0 MOTOR_DRIVER_3.VIN1
  Top 1.778: MOTOR_DRIVER_3.VIN2 42.39,30.05
  Top 2.54: S_MOTORI.2 27.78,9.73
  Top 3.302: 27.78,9.73 29.69,9.73 32.23,9.73 34.77,12.27 34.77,16.08 42.39,23.7 42.39,30.05 42.39,33.86 42.39,47.32 42.39,50.37 | 42.39,50.37 65.25,50.37 85.57,30.05 MOTOR_DRIVER_2.VIN2 | 42.39,50.37 42.39,52.66 42.39,56.72 46.2,60.53 MOTOR_DRIVER_4.VIN2

### Text on the board
tNames: LS_OVEST | LS_NORD | LS_EST | LS_SUD_R | LS_SUD_L | 5V | 5V/S